# Altium schematic sheet Sheet1_1.SchDoc
size 431 x 279 mm; Organization: ORGANIZATION; Address1: ADDRESS 1; Address2: ADDRESS 2; Address3: ADDRESS 3; Address4: ADDRESS 4; Revision: -; ENG_APP_DATE: --/--/--; DSN_APP_DATE: --/--/--; CHK_APP_DATE: --/--/--
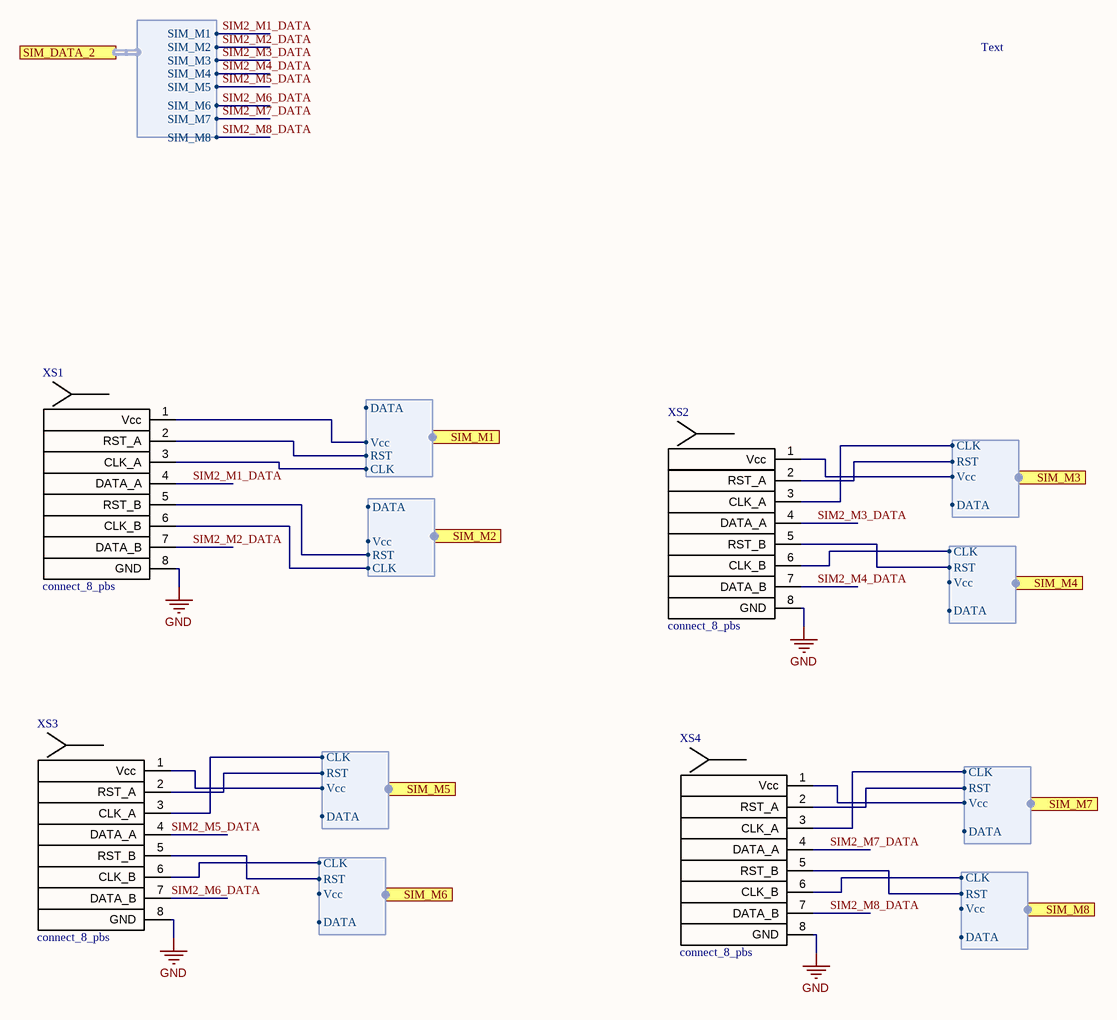
[diagram p0: Sheet1_1.SchDoc]

## Parts
XS1  connect_8_pbs  [PBS_8]
XS2  connect_8_pbs  [PBS_8]
XS3  connect_8_pbs  [PBS_8]
XS4  connect_8_pbs  [PBS_8]

## Ports
SIM_DATA_2 (harness SIM_DATA_2), SIM_M1 (harness SIM), SIM_M2 (harness SIM), SIM_M3 (harness SIM), SIM_M4 (harness SIM), SIM_M5 (harness SIM), SIM_M6 (harness SIM), SIM_M7 (harness SIM), SIM_M8 (harness SIM)

## Harnesses
SIM_DATA_2: SIM_M1, SIM_M2, SIM_M3, SIM_M4, SIM_M5, SIM_M6, SIM_M7, SIM_M8
SIM: Vcc, RST, CLK, DATA

## Nets
GND: XS1.8(GND) XS2.8(GND) XS3.8(GND) XS4.8(GND)
SIM2_M1_DATA: XS1.4(DATA_A) ; port SIM_DATA_2.SIM_M1
SIM2_M2_DATA: XS1.7(DATA_B) ; port SIM_DATA_2.SIM_M2
SIM2_M3_DATA: XS2.4(DATA_A) ; port SIM_DATA_2.SIM_M3
SIM2_M4_DATA: XS2.7(DATA_B) ; port SIM_DATA_2.SIM_M4
SIM2_M5_DATA: XS3.4(DATA_A) ; port SIM_DATA_2.SIM_M5
SIM2_M6_DATA: XS3.7(DATA_B) ; port SIM_DATA_2.SIM_M6
SIM2_M7_DATA: XS4.4(DATA_A) ; port SIM_DATA_2.SIM_M7
SIM2_M8_DATA: XS4.7(DATA_B) ; port SIM_DATA_2.SIM_M8
NetXS1_1: XS1.1(Vcc) ; port SIM_M1.Vcc
NetXS1_2: XS1.2(RST_A) ; port SIM_M1.RST
NetXS1_3: XS1.3(CLK_A) ; port SIM_M1.CLK
NetXS1_5: XS1.5(RST_B) ; port SIM_M2.RST
NetXS1_6: XS1.6(CLK_B) ; port SIM_M2.CLK
NetXS2_1: XS2.1(Vcc) ; port SIM_M3.Vcc
NetXS2_2: XS2.2(RST_A) ; port SIM_M3.RST
NetXS2_3: XS2.3(CLK_A) ; port SIM_M3.CLK
NetXS2_5: XS2.5(RST_B) ; port SIM_M4.RST
NetXS2_6: XS2.6(CLK_B) ; port SIM_M4.CLK
NetXS3_1: XS3.1(Vcc) ; port SIM_M5.Vcc
NetXS3_2: XS3.2(RST_A) ; port SIM_M5.RST
NetXS3_3: XS3.3(CLK_A) ; port SIM_M5.CLK
NetXS3_5: XS3.5(RST_B) ; port SIM_M6.RST
NetXS3_6: XS3.6(CLK_B) ; port SIM_M6.CLK
NetXS4_1: XS4.1(Vcc) ; port SIM_M7.Vcc
NetXS4_2: XS4.2(RST_A) ; port SIM_M7.RST
NetXS4_3: XS4.3(CLK_A) ; port SIM_M7.CLK
NetXS4_5: XS4.5(RST_B) ; port SIM_M8.RST
NetXS4_6: XS4.6(CLK_B) ; port SIM_M8.CLK

## Notes on the sheet
- Text
- DWG. NO.
- REV.
- SHT.
- THIS DOCUMENT AND THE DATA DISCLOSED HEREIN OR HEREWITH IS THE PROPERTY OF ALTIUM LIMITED AND MAY BE FREELY DISTRIBUTED IN WHOLE. NO RIGHTS ARE RESERVED OR EXPRESS OR IMPLIED WARANTEE GIVEN.
- REVISION
- DESCRIPTION
- DATE
- APPROVED
- ENG:
- APPROVALS
- PROJECT
- DSN:
- CHK:
- REFERENCE DOCUMENTS
- PROJECT REVISION:
- TITLE
- DOCUMENT REVISION:
- DESIGN ITEM:
- BOM:
- FAB DWG:
- PCB DWG:
- ASSY DWG:
- SCALE:
- SIZE
- B
- CAGE CODE
- FILE NAME
- DWG NO.
- SHEET
- OF
- REV

## Library data of the parts
XS1-XS4 = connect_8_pbs: PBS-8 (DS-1023 -1x 8); ManufacturerName: Connfly; System: Connector; Assembly: PBS-8 (DS-1023 -1x 8); PartNumber: PBS-8 (DS-1023 -1x 8)